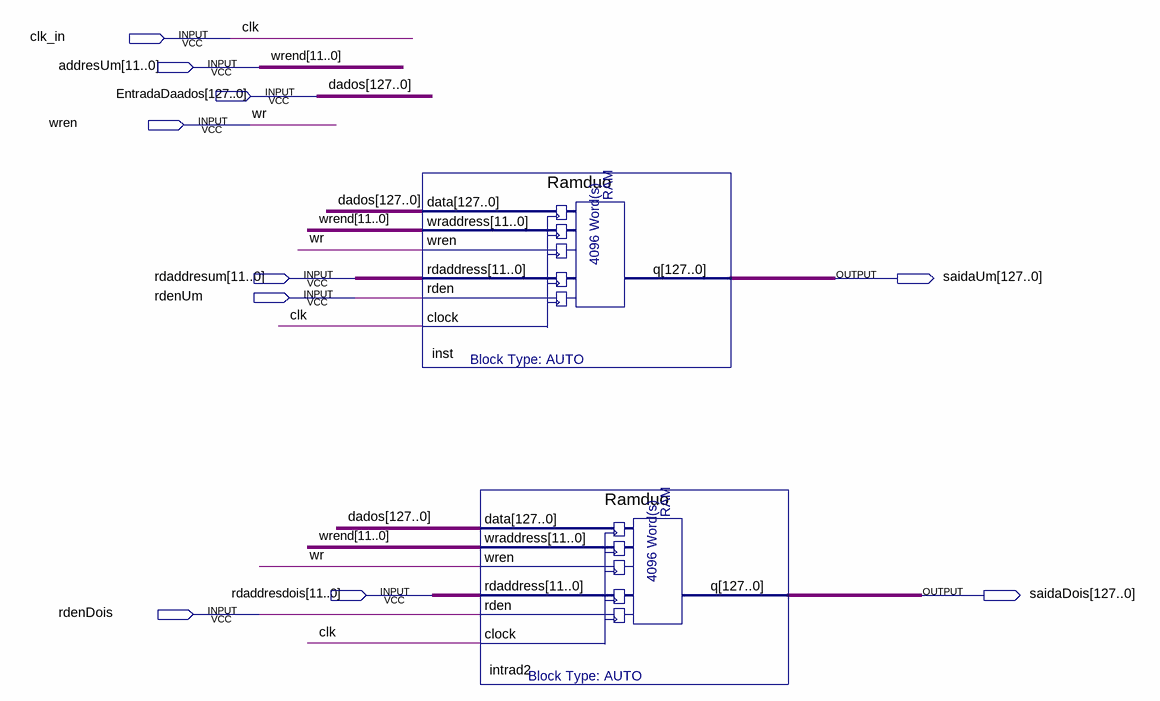
[diagram p0: schematic sheet]
// Quartus schematic DualRam.bdf as structural Verilog: 2 symbols, 10 pins
module DualRam (
  input  clk_in,
  input  [11:0] addresUm,
  input  [127:0] EntradaDaados,
  input  wren,
  input  [11:0] rdaddresum,
  input  rdenUm,
  input  [11:0] rdaddresdois,
  input  rdenDois,
  output [127:0] saidaUm,
  output [127:0] saidaDois
);

  Ramduo inst (
    .data(EntradaDaados), .wraddress(addresUm), .wren(wren), .rdaddress(rdaddresum), .rden(rdenUm),
    .clock(clk_in), .q(saidaUm));
  Ramduo intrad2 (
    .data(EntradaDaados), .wraddress(addresUm), .wren(wren), .rdaddress(rdaddresdois), .rden(rdenDois),
    .clock(clk_in), .q(saidaDois));

  // Other names for the same wires on the sheet: clk = clk_in; dados[127:0] = EntradaDaados; wr = wren;
  //   wrend[11:0] = addresUm
endmodule
